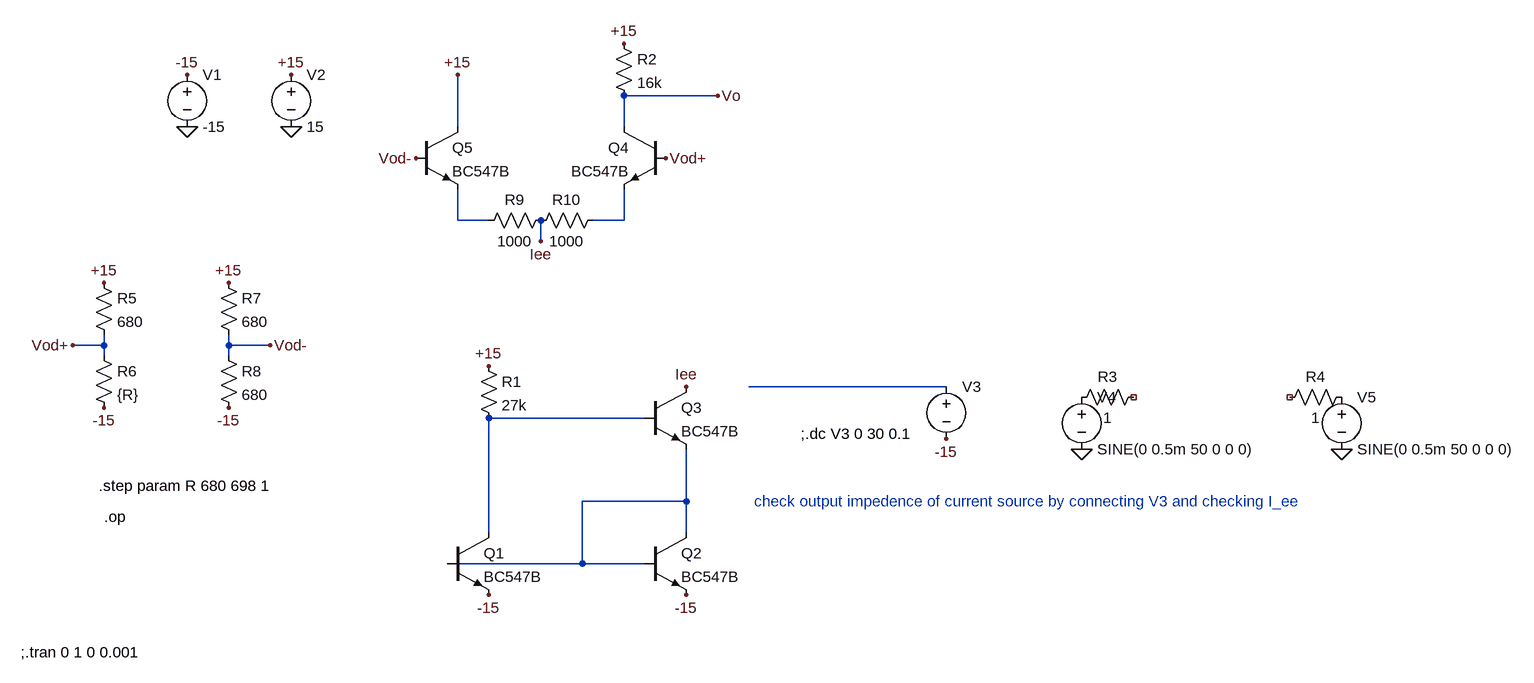
[diagram p0: schematic Draft1.asc]
Draft1.asc, the LTspice schematic file:
Version 4
SHEET 1 2152 732
WIRE -256 -960 -400 -960
WIRE -656 -912 -656 -992
WIRE -400 -912 -400 -960
WIRE -656 -768 -656 -816
WIRE -608 -768 -656 -768
WIRE -400 -768 -400 -816
WIRE -400 -768 -448 -768
WIRE -528 -736 -528 -768
WIRE -1200 -576 -1200 -592
WIRE -1200 -576 -1248 -576
WIRE -1008 -576 -1008 -592
WIRE -944 -576 -1008 -576
WIRE -1200 -560 -1200 -576
WIRE -1008 -560 -1008 -576
WIRE 96 -512 -208 -512
WIRE -368 -464 -608 -464
WIRE -304 -336 -304 -416
WIRE -304 -336 -464 -336
WIRE -608 -288 -608 -464
WIRE -304 -288 -304 -336
WIRE -464 -240 -464 -336
WIRE -464 -240 -672 -240
WIRE -368 -240 -464 -240
FLAG -1072 -912 0
FLAG -912 -912 0
FLAG -1072 -992 -15
FLAG -912 -992 +15
FLAG -608 -544 +15
FLAG -608 -192 -15
FLAG -304 -192 -15
FLAG 96 -432 -15
FLAG -256 -960 Vo
FLAG -656 -992 +15
FLAG -400 -1040 +15
FLAG 304 -416 0
FLAG 704 -416 0
FLAG -304 -512 Iee
FLAG -528 -736 Iee
FLAG -1248 -576 Vod+
FLAG -944 -576 Vod-
FLAG -1200 -480 -15
FLAG -1008 -480 -15
FLAG -1008 -672 +15
FLAG -1200 -672 +15
FLAG -336 -864 Vod+
FLAG -720 -864 Vod-
SYMBOL npn -368 -288 R0
SYMATTR InstName Q2
SYMATTR Value BC547B
SYMBOL voltage -1072 -1008 R0
WINDOW 123 0 0 Left 0
WINDOW 39 0 0 Left 0
SYMATTR InstName V1
SYMATTR Value -15
SYMBOL voltage -912 -1008 R0
WINDOW 123 0 0 Left 0
WINDOW 39 0 0 Left 0
SYMATTR InstName V2
SYMATTR Value 15
SYMBOL npn -672 -288 R0
SYMATTR InstName Q1
SYMATTR Value BC547B
SYMBOL npn -368 -512 R0
SYMATTR InstName Q3
SYMATTR Value BC547B
SYMBOL res -624 -560 R0
SYMATTR InstName R1
SYMATTR Value 27k
SYMBOL voltage 96 -528 R0
WINDOW 123 0 0 Left 0
WINDOW 39 0 0 Left 0
SYMATTR InstName V3
SYMATTR Value ""
SYMBOL npn -336 -912 M0
SYMATTR InstName Q4
SYMATTR Value BC547B
SYMBOL npn -720 -912 R0
SYMATTR InstName Q5
SYMATTR Value BC547B
SYMBOL res -416 -1056 R0
SYMATTR InstName R2
SYMATTR Value 16k
SYMBOL voltage 304 -512 R0
WINDOW 123 0 0 Left 0
WINDOW 39 0 0 Left 0
SYMATTR InstName V4
SYMATTR Value SINE(0 0.5m 50 0 0 0)
SYMBOL voltage 704 -512 R0
WINDOW 123 0 0 Left 0
WINDOW 39 0 0 Left 0
SYMATTR InstName V5
SYMATTR Value SINE(0 0.5m 50 0 0 0)
SYMBOL res 400 -512 R90
WINDOW 0 0 56 VBottom 2
WINDOW 3 32 56 VTop 2
SYMATTR InstName R3
SYMATTR Value 1
SYMBOL res 720 -512 R90
WINDOW 0 0 56 VBottom 2
WINDOW 3 32 56 VTop 2
SYMATTR InstName R4
SYMATTR Value 1
SYMBOL res -1216 -688 R0
SYMATTR InstName R5
SYMATTR Value 680
SYMBOL res -1216 -576 R0
SYMATTR InstName R6
SYMATTR Value {R}
SYMBOL res -1024 -688 R0
SYMATTR InstName R7
SYMATTR Value 680
SYMBOL res -1024 -576 R0
SYMATTR InstName R8
SYMATTR Value 680
SYMBOL res -512 -784 R90
WINDOW 0 0 56 VBottom 2
WINDOW 3 32 56 VTop 2
SYMATTR InstName R9
SYMATTR Value 1000
SYMBOL res -432 -784 R90
WINDOW 0 0 56 VBottom 2
WINDOW 3 32 56 VTop 2
SYMATTR InstName R10
SYMATTR Value 1000
TEXT -128 -440 Left 2 !;.dc V3 0 30 0.1
TEXT -1208 -360 Left 2 !.step param R 680 698 1
TEXT -1200 -312 Left 2 !.op
TEXT -1328 -104 Left 2 !;.tran 0 1 0 0.001
TEXT -200 -336 Left 2 ;check output impedence of current source by connecting V3 and checking I_ee

The netlist it stands for:
* Draft1.asc
Q2 N005 N005 -15 0 BC547B
V1 -15 0 -15
V2 +15 0 15
Q1 N004 N005 -15 0 BC547B
Q3 Iee N004 N005 0 BC547B
R1 +15 N004 27k
V3 N003 -15
Q4 Vo Vod+ N002 0 BC547B
Q5 +15 Vod- N001 0 BC547B
R2 +15 Vo 16k
V4 P001 0 SINE(0 0.5m 50 0 0 0)
V5 P002 0 SINE(0 0.5m 50 0 0 0)
R3 NC_01 P001 1
R4 P002 NC_02 1
R5 +15 Vod+ 680
R6 Vod+ -15 {R}
R7 +15 Vod- 680
R8 Vod- -15 680
R9 Iee N001 1000
R10 N002 Iee 1000
.model NPN NPN
.model PNP PNP
.lib standard.bjt
;.dc V3 0 30 0.1
.step param R 680 698 1
.op
;.tran 0 1 0 0.001
* check output impedence of current source by connecting V3 and checking I_ee
.backanno
.end

* Results of the author's LTspice run, read from the files saved beside the schematic
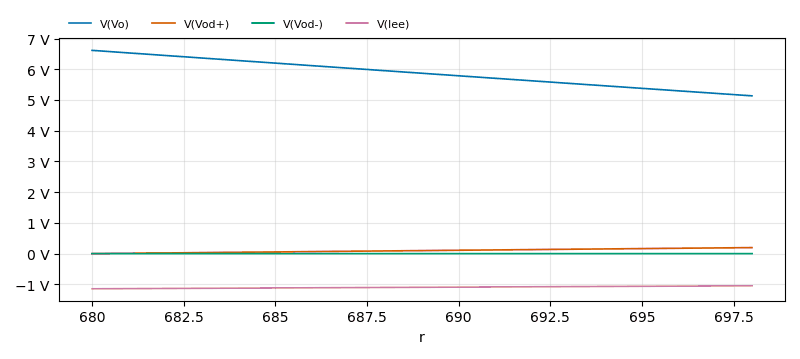
[diagram p1: Operating Point of Draft1.asc, plotted from the saved traces]
* Operating Point, 1 run:
*   V(Vo): 6.614 V at r=680 , 5.135 V at r=698 , min 5.135 V, max 6.614 V
*   V(Vod+): -568.9 µV at r=680 , 195.2 mV at r=698 , min -568.9 µV, max 195.2 mV
*   V(Vod-): -509.7 µV at r=680 , -420.3 µV at r=698 , min -509.7 µV, max -420.3 µV
*   V(Iee): -1.145 V at r=680 , -1.047 V at r=698 , min -1.145 V, max -1.047 V
* From the log:
*   Semiconductor Device Operating Points:
*                           --- Bipolar Transistors ---
*   Name:       q5          q4          q3          q1          q2
*   Model:    bc547b      bc547b      bc547b      bc547b      bc547b
*   Ib:       1.50e-06    1.67e-06    3.10e-06    3.72e-06    3.72e-06
*   Ic:       5.27e-04    5.24e-04    1.05e-03    1.06e-03    1.05e-03
*   Vbe:      6.16e-01    6.19e-01    6.36e-01    6.40e-01    6.40e-01
*   Vbc:     -1.50e+01   -6.62e+00   -1.26e+01   -6.36e-01    0.00e+00
*   Vce:      1.56e+01    7.23e+00    1.32e+01    1.28e+00    6.40e-01
*   BetaDC:   3.52e+02    3.13e+02    3.40e+02    2.85e+02    2.82e+02
*   Gm:       2.01e-02    2.00e-02    4.01e-02    4.03e-02    3.99e-02
*   Rpi:      1.75e+04    1.56e+04    8.44e+03    7.03e+03    7.03e+03
*   Rx:       1.00e+00    1.00e+00    1.00e+00    1.00e+00    1.00e+00
*   Ro:       1.45e+05    1.30e+05    7.04e+04    5.87e+04    5.87e+04
*   Cbe:      4.46e-11    4.56e-11    6.17e-11    6.40e-11    6.38e-11
*   Cbc:      7.85e-13    9.90e-13    8.26e-13    1.74e-12    2.31e-12
*   Cjs:      0.00e+00    0.00e+00    0.00e+00    0.00e+00    0.00e+00
*   BetaAC:   3.52e+02    3.13e+02    3.39e+02    2.83e+02    2.80e+02
*   Cbx:      4.82e-13    6.09e-13    5.07e-13    1.07e-12    1.42e-12
*   Ft:       6.99e+07    6.75e+07    1.01e+08    9.61e+07    9.41e+07